# Altium project AMC_FMC_Carrier v4.PrjPcb (part 10 of 18)

## Sheet SUP_1.2_1.8.SchDoc: AMC FMC Carrier v4
size A4; CompanyName: WUT; Organization: WUT ISE; Address1: Warsaw Univeristy of Technology; Address2: Nowowiejska 15/19 00-665 Warsaw; Address3: t.przywozki@gmail.com; Revision: 1; SheetNumber: 11; SheetTotal: 29; Project: AMC FMC Carrier v4; ModifiedBy: -; CreateDate: XX/XX/XXXX; CheckedDate: -; Title2: Power P1V2 & P1V8; DivGrp: ISE; Designer: T. Przywozki; ModifiedDate: -; ProjectName: ADC/DAC MEZZANINE
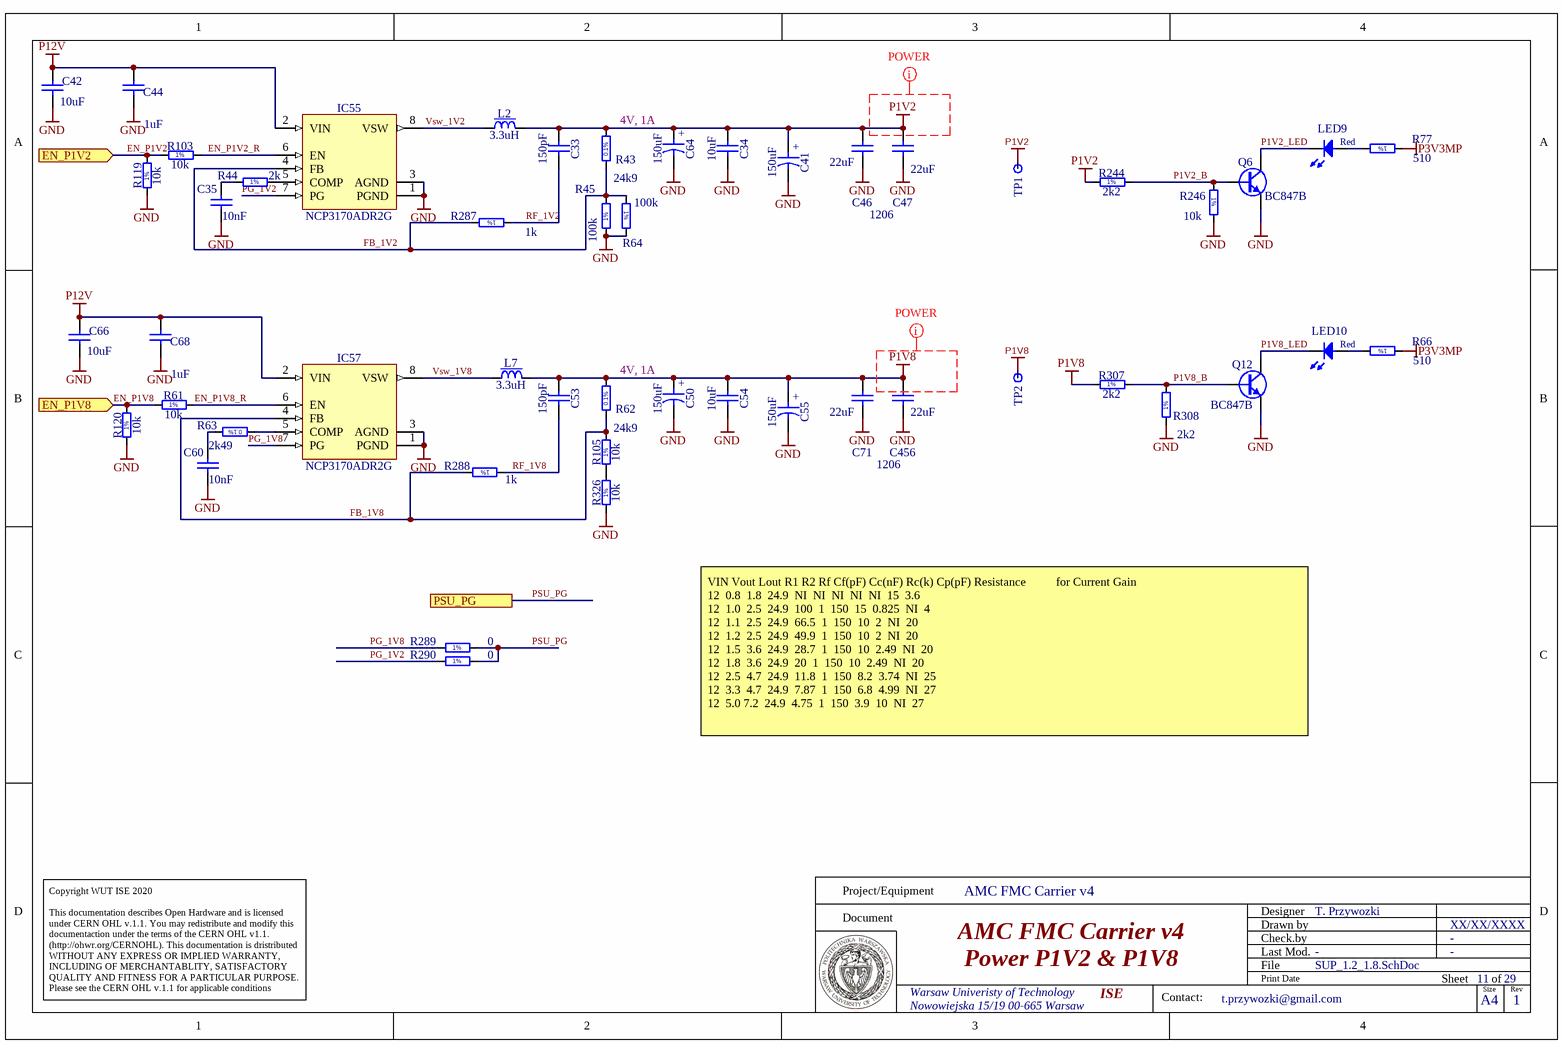
[diagram p17: SUP_1.2_1.8.SchDoc]

### Parts
C33  150pF  [CAPC1608X87N]
C34  10uF  [CAPC2012X135N]
C35  10nF  [CAPC1005X55N]
C41  150uF  [CAPMP7343X200N]
C42  10uF  [CAPC2012X135N]
C44  1uF  [CAPC1608X87N]
C46  22uF  [CAPC3216X180N]
C47  22uF  Case: 1206  [CAPC3216X180N]
C50  150uF  [CAPMP7343X200N]
C53  150pF  [CAPC1608X87N]
C54  10uF  [CAPC2012X135N]
C55  150uF  [CAPMP7343X200N]
C60  10nF  [CAPC1005X55N]
C64  150uF  [CAPMP7343X200N]
C66  10uF  [CAPC2012X135N]
C68  1uF  [CAPC1608X87N]
C71  22uF  [CAPC3216X180N]
C456  22uF  Case: 1206  [CAPC3216X180N]
IC55  NCP3170ADR2G  [SOIC127P600X175-8N]
IC57  NCP3170ADR2G  [SOIC127P600X175-8N]
L2  3.3uH  [IND_WURTH_WE-PD4_L]
L7  3.3uH  [IND_WURTH_WE-PD4_L]
LED9  Red  [LED_KINGBRIGHT_KPH-1608SURCK]
LED10  Red  [LED_KINGBRIGHT_KPH-1608SURCK]
Q6  BC847B  [SOT95P230X110-3N]
Q12  BC847B  [SOT95P230X110-3N]
R43  24k9  [RESC1608X55N]
R44  2k  [RESC1608X55N]
R45  100k  [RESC1005X40N]
R61  10k  [RESC1005X40N]
R62  24k9  [RESC1608X55N]
R63  2k49  [RESC1608X55N]
R64  100k  [RESC1005X40N]
R66  510  [RESC1005X40N]
R77  510  [RESC1005X40N]
R103  10k  [RESC1005X40N]
R105  10k  [RESC1005X40N]
R119  10k  [RESC1005X40N]
R120  10k  [RESC1005X40N]
R244  2k2  [RESC1005X40N]
R246  10k  [RESC1005X40N]
R287  1k  [RESC1005X40N]
R288  1k  [RESC1005X40N]
R289  0  [RESC1005X40N]
R290  0  [RESC1005X40N]
R307  2k2  [RESC1005X40N]
R308  2k2  [RESC1005X40N]
R326  10k  [RESC1005X40N]
TP1  Test Point  [TPS127]  (value not drawn)
TP2  Test Point  [TPS127]  (value not drawn)

### Ports
EN_P1V2 (in), EN_P1V8 (in), PSU_PG

### Nets
GND: C34.2 C35.2 C41.2 C42.1 C44.1 C46.2 C47.2 C50.2 C54.2 C55.2 C60.1 C64.2 C66.1 C68.1 C71.2 C456.2 IC55.1(PGND) IC55.3(AGND) IC57.1(PGND) IC57.3(AGND) Q6.2(E) Q12.2(E) R45.1 R64.2 R119.1 R120.1 R246.2 R308.1 R326.1
P1V2: C33.1 C34.1 C41.1 C46.1 C47.1 C64.1 L2.2 R43.2 R244.1 TP1.1
P1V8: C50.1 C53.1 C54.1 C55.1 C71.1 C456.1 L7.2 R62.2 R307.1 TP2.1
P3V3MP: R66.1 R77.1
P12V: C42.2 C44.2 C66.2 C68.2 IC55.2(VIN) IC57.2(VIN)
EN_P1V2: R103.1 R119.2 ; port EN_P1V2  [project net PM.EN_P1V2]
EN_P1V2_R: IC55.6(EN) R103.2
EN_P1V8: R61.1 R120.2 ; port EN_P1V8  [project net PM.EN_P1V8]
EN_P1V8_R: IC57.6(EN) R61.2
FB_1V2: IC55.4(FB) R43.1 R45.2 R64.1 R287.2
FB_1V8: IC57.4(FB) R62.1 R105.2 R288.2
P1V2_B: Q6.1(B) R244.2 R246.1
P1V2_LED: LED9.1(C) Q6.3(C)
P1V8_B: Q12.1(B) R307.2 R308.2
P1V8_LED: LED10.1(C) Q12.3(C)
PG_1V2: IC55.7(PG) R290.2
PG_1V8: IC57.7(PG) R289.2
PSU_PG: R289.1 R290.1 ; port PSU_PG  [project net PM.PGOOD_P1V0]
RF_1V2: C33.2 R287.1
RF_1V8: C53.2 R288.1
Vsw_1V2: IC55.8(VSW) L2.1
Vsw_1V8: IC57.8(VSW) L7.1
NetC35_1: C35.1 R44.2
NetC60_2: C60.2 R63.1
NetIC55_5: IC55.5(COMP) R44.1
NetIC57_5: IC57.5(COMP) R63.2
NetLED9_2: LED9.2(A) R77.2
NetLED10_2: LED10.2(A) R66.2
NetR105_1: R105.1 R326.2

### Layout directives
net class POWER: P1V2, P1V8

### Notes on the sheet
- 4V, 1A
- VIN	Vout	Lout	R1	R2	Rf	Cf(pF)	Cc(nF)	Rc(k)	Cp(pF) Resistance 									for Current Gain
  12 	0.8 	1.8 	24.9 	NI 	NI 	NI 	NI 	NI 	15 	3.6
  12 	1.0 	2.5 	24.9 	100 	1 	150 	15 	0.825 	NI 	4
  12 	1.1 	2.5 	24.9 	66.5 	1 	150 	10 	2 	NI 	20
  12 	1.2 	2.5 	24.9 	49.9 	1 	150 	10 	2 	NI 	20
  12 	1.5 	3.6 	24.9 	28.7 	1 	150 	10 	2.49 	NI 	20
  12 	1.8 	3.6 	24.9 	20 	1 	150 	10 	2.49 	NI 	20
  12 	2.5 	4.7 	24.9 	11.8 	1 	150 	8.2 	3.74 	NI 	25
  12 	3.3 	4.7 	24.9 	7.87 	1 	150 	6.8 	4.99 	NI 	27
  12 	5.0	7.2 	24.9 	4.75 	1 	150 	3.9 	10 	NI 	27
- Project/Equipment
- Document
- Designer
- Drawn by
- Check.by
- Copyright WUT ISE 2020
  This documentation describes Open Hardware and is licensed under CERN OHL v.1.1. You may redistribute and modify this documentaction under the terms of the CERN OHL v1.1.
  (http://ohwr.org/CERNOHL). This documentation is dristributed WITHOUT ANY EXPRESS OR IMPLIED WARRANTY, INCLUDING OF MERCHANTABLITY, SATISFACTORY QUALITY AND FITNESS FOR A PARTICULAR PURPOSE. Please see the CERN OHL v.1.1 for applicable conditions
- File
- Last Mod.
- Print Date
- Sheet
- Size
- A4
- of
- Rev
- Contact:
- (in symbol CAEM7343-20_150UF_2V_20%_LESR0009) +
- (in symbol R0402_0R_JUMPER) 1%
- (in symbol R0402_1K_1%_0.0625W_100PPM) 1%
- (in symbol R0402_2K2_1%_0.0625W_100PPM) 1%
- (in symbol R0402_10K_1%_0.0625W_100PPM) 1%
- (in symbol R0402_100K_1%_0.0625W_100PPM) 1%
- (in symbol R0402_510R_1%_0.0625W_100PPM) 1%
- (in symbol R0603_2K49_0.1%_0.063W_10PPM) 0.1%
- (in symbol R0603_2K_1%_0.1W_100PPM) 1%
- (in symbol R0603_24K9_0.1%_0.063W_10PPM) 0.1%

### Library data of the parts
C33 C53 = CC0603_150PF_50V_5%_NP0: Non-polarised capacitor; Part Description: SMD Multilayer Chip Ceramic Capacitor; Manufacturer: GENERIC; Manufacturer1 Part Number: 223886715151; Voltage: 50V; TC: NP0; Tolerance: ±5%; Table: Capacitors SMD; Part Number: CC0603_150PF_50V_5%_NP0; Component Kind: Standard; Component Type: Standard; Pin Count: 2; Value: 150pF; Status: Preferred; Manufacturer Part Number: CC0603_150PF_50V_5%_NP0; Case: 0603; Mounted: Yes; Socket: No; SMD: Yes; Manufacturer1 Example: PHYCOMP; Manufacturer1 ComponentHeight: 0.87mm; HelpURL: \\cern.ch\dfs\Applications\Altium\Datasheets\CC0603_NP0_PHYCOMP.pdf; Author: CERN DEM JLC; CreateDate: 2007-12-03; LatestRevisionDate: 2007-12-03
C34 C42 C54 C66 = CC0805_10UF_16V_10%_X5R: as C40 on sheet SUP_2.5_FMC; Part Number: CC0805_10UF_16V_10%_X5R; Component Kind: Standard; Component Type: Standard; Pin Count: 2; Value: 10uF; Status: Preferred; Manufacturer Part Number: CC0805_10UF_16V_10%_X5R; Case: 0805; Mounted: Yes; Socket: No; SMD: Yes; Manufacturer1 Example: KEMET; Manufacturer1 ComponentHeight: 1.4mm; HelpURL: \\cern.ch\dfs\Applications\Altium\Datasheets\CC1206_X5R_KEMET.pdf; Author: CERN DEM JLC; CreateDate: 2007-12-03; LatestRevisionDate: 2007-12-03
C35 C60 = CC0402_10NF_16V_10%_X7R: as C547 on sheet SUP_1.5_3.3; Part Number: CC0402_10NF_16V_10%_X7R; Component Kind: Standard; Component Type: Standard; Pin Count: 2; Value: 10nF; Status: Not Recommended; Manufacturer Part Number: CC0402_10NF_16V_10%_X7R; Case: 0402; Mounted: Yes; Socket: No; SMD: Yes; Manufacturer1 Example: PHYCOMP; Manufacturer1 ComponentHeight: 0.55mm; HelpURL: \\cern.ch\dfs\Applications\Altium\Datasheets\CC0402_X7R_PHYCOMP.pdf; Author: CERN DEM JLC; CreateDate: 2007-12-03; LatestRevisionDate: 2007-12-03
C41 C50 C55 C64 = CAEM7343-20_150UF_2V_20%_LESR0009: as C528 on sheet SUP_1.5_3.3; Part Number: CAEM7343-20_150UF_2V_20%_LESR0009; Component Kind: Standard; Component Type: Standard; Pin Count: 2; Value: 150uF; Status: None; Mounted: Yes; Socket: No; SMD: Yes; Sense: No; ComponentHeight: 2mm; HelpURL: \\cern.ch\dfs\Applications\Altium\Datasheets\CAEM_MURATA_ECAS.pdf; Author: CERN DEM JLC; CreateDate: 11.01.2012; LatestRevisionDate: 11.01.2012
C44 C68 = CC0603_1UF_16V_10%_X7R: as C816 on sheet POWER_Management; Part Number: CC0603_1UF_16V_10%_X7R; Component Kind: Standard; Component Type: Standard; Pin Count: 2; Value: 1uF; Status: Preferred; Manufacturer Part Number: CC0603_1uF_16V_10%_X7R; Case: 0603; Mounted: Yes; Socket: No; SMD: Yes; Manufacturer1 Example: PHYCOMP; Manufacturer1 ComponentHeight: 0.87mm; HelpURL: \\cern.ch\dfs\Applications\Altium\Datasheets\CC0805_X5R_PHYCOMP_HC.pdf; Author: CERN DEM JLC; CreateDate: 2007-12-03; LatestRevisionDate: 2007-12-03
C46 C47 C71 C456 = CC1206_22UF_10V_10%_X7R: as C79 on sheet SUP_2.5_FMC; Part Number: CC1206_22UF_10V_10%_X7R; Component Kind: Standard; Component Type: Standard; Pin Count: 2; Value: 22uF; Status: Preferred; Manufacturer Part Number: CC1206_22UF_10V_10%_X7R; Mounted: Yes; Socket: No; SMD: Yes; Manufacturer1 Example: MURATA; Manufacturer1 ComponentHeight: 1.8mm; HelpURL: \\cern.ch\dfs\Applications\Altium\Datasheets\CC1206_X7R_MURATA_GRM-HI-CAP.pdf; Author: CERN DEM JLC; CreateDate: 08/06/2010; LatestRevisionDate: 08/06/2010
IC55 IC57 = NCP3170ADR2G: Synchronous PWM Switching Converter; Manufacturer: ON SEMICONDUCTOR; PressFit: No; Bonding: No; Part Number: NCP3170ADR2G; Component Kind: Standard; Component Type: Standard; Device: NCP3170ADR2G; PackageDescription: SOIC 8, Pitch 1.27mm, Body 4x5mm, IPC Medium Density; Part Description: Synchronous PWM Switching Converter; Manufacturer Part Number: NCP3170ADR2G; Pin Count: 8; Case: SOIC8; Mounted: Yes; Socket: No; SMD: Yes; Sense: No; ComponentHeight: 1.75mm; Author: CERN DEM MR; HelpURL: \\cern.ch\dfs\Applications\Altium\Datasheets\NCP3170ADR2G.pdf; CreateDate: 30.05.2016; LatestRevisionDate: 30.05.2016
L2 L7 = IND_3.3UH_20%_WURTH_WE-PD4_74456033: Inductor With Core; Part Description: Power Inductor (WE-PD 4 Series); Manufacturer: WURTH ELEKTRONIK; Power: 5.3A; Resistance: 0.015R; Tolerance: ±20%; Part Number: IND_3.3UH_20%_WURTH_WE-PD4_74456033; Component Kind: Standard; Component Type: Standard; Pin Count: 2; Value: 3.3uH; Status: None; Manufacturer Part Number: 74456033; Mounted: Yes; Socket: No; SMD: Yes; Sense: No; ComponentHeight: 5.3mm; HelpURL: \\cern.ch\dfs\Applications\Altium\Datasheets\IND_WURTH_WE-PD4_74456033.pdf; Author: CERN DEM JLC; CreateDate: 07.06.2011; LatestRevisionDate: 24.01.2012
LED9 LED10 = LED_KINGBRIGHT_KPH-1608SURCK: as LED6 on sheet POWER_Management; Part Number: LED_KINGBRIGHT_KPH-1608SURCK; Component Kind: Standard; Component Type: Standard; Color: Red; PackageDescription: SMT Hyper Red LED, Case 0603, Body L 1.6 x W 0.8mm H 0.65mm; Manufacturer: KINGBRIGHT; Manufacturer Part Number: KPH-1608SURCK; Pin Count: 2; Mounted: Yes; Socket: No; SMD: Yes; Sense: No; ComponentHeight: 0.65mm; HelpURL: \\cern.ch\dfs\Applications\Altium\Datasheets\LED_KINGBRIGHT_KPH-1608SURCK.pdf; Author: CERN DEM JLC; CreateDate: 03.07.2017; LatestRevisionDate: 03.07.2017
Q6 Q12 = BC847B: NPN Transistor; Part Description: 45V 100mA NPN general-purpose transistors; Manufacturer: NXP SEMICONDUCTORS; PressFit: No; Bonding: No; Part Number: BC847B; Component Kind: Standard; Component Type: Standard; Device: BC847B; PackageDescription: SOT23, 3 pin, Pitch 0.95mm - 1.3mm W X 2.9mm L X 1.1mm H, IPC Medium Density; Manufacturer Part Number: BC847B; Pin Count: 3; Case: SOT23-3; Mounted: Yes; Socket: No; SMD: Yes; Sense: No; ComponentHeight: 1.1mm; HelpURL: \\cern.ch\dfs\Applications\Altium\Datasheets\BC847B.pdf; Author: CERN DEM JLC; CreateDate: 14.06.2011; LatestRevisionDate: 14.06.2011
R43 R62 = R0603_24K9_0.1%_0.063W_10PPM: Resistor - 0.1%; Part Description: Thin Film Chip Resistor; Manufacturer: GENERIC; Manufacturer1 Part Number: RN73C1J24K9BTDF; Power: 0.063W; TC: ±10ppm; Table: Resistors SMD; Part Number: R0603_24K9_0.1%_0.063W_10PPM; Component Kind: Standard; Component Type: Standard; Pin Count: 2; Value: 24k9; Status: Not recommended; Tolerance: ±0.1%; Manufacturer Part Number: R0603_24K9_0.1%_0.063W_10PPM; Case: 0603; Mounted: Yes; Socket: No; SMD: Yes; Manufacturer1 Example: TYCO HOLSWORTHY; Manufacturer1 ComponentHeight: 0.5mm; HelpURL: \\cern.ch\dfs\Applications\Altium\Datasheets\R0603_Tyco_RN73.pdf; Author: CERN DEM JLC; CreateDate: 2007-12-03; LatestRevisionDate: 2008-03-13
R44 = R0603_2K_1%_0.1W_100PPM: Resistor - 1%; Part Description: General Purpose Thick Film Chip Resistor; Manufacturer: GENERIC; Manufacturer1 Part Number: NRC06F2001TRF; Power: 0.1W; TC: ±100ppm/°C; PressFit: No; Part Number: R0603_2K_1%_0.1W_100PPM; Component Kind: Standard; Component Type: Standard; Pin Count: 2; Value: 2k; Status: Preferred; Tolerance: ±1%; Manufacturer Part Number: R0603_2K_1%_0.1W_100PPM; Case: 0603; Mounted: Yes; Sense: No; Socket: No; SMD: Yes; Manufacturer1 Example: NIC COMPONENT; Manufacturer1 ComponentHeight: 0.55mm; HelpURL: \\cern.ch\dfs\Applications\Altium\Datasheets\R0603_NIC_NRC.pdf; Author: CERN DEM JLC; CreateDate: 03.12.2007; LatestRevisionDate: 13.03.2008
R45 R64 = R0402_100K_1%_0.0625W_100PPM: as R269 on sheet POWER_Management; Part Number: R0402_100K_1%_0.0625W_100PPM; Component Kind: Standard; Component Type: Standard; Pin Count: 2; Value: 100k; Status: Not recommended; Power: 0.0625W; Tolerance: ±1%; Manufacturer Part Number: R0402_100K_1%_0.0625W_100PPM; Case: 0402; Mounted: Yes; Socket: No; SMD: Yes; Manufacturer1 Example: YAGEO PHYCOMP; Manufacturer1 ComponentHeight: 0.4mm; HelpURL: \\cern.ch\dfs\Applications\Altium\Datasheets\R0402_Phycomp_RC0402.pdf; Author: CERN DEM JLC; CreateDate: 2007-12-03; LatestRevisionDate: 2012-10-17
R61 R103 R105 R119 R120 R246 R326 = R0402_10K_1%_0.0625W_100PPM: as R37-R40 on sheet POWER_Management; Part Number: R0402_10K_1%_0.0625W_100PPM; Component Kind: Standard; Component Type: Standard; Pin Count: 2; Value: 10k; Status: Not recommended; Power: 0.0625W; Tolerance: ±1%; Manufacturer Part Number: R0402_10K_1%_0.0625W_100PPM; Case: 0402; Mounted: Yes; Socket: No; SMD: Yes; Manufacturer1 Example: YAGEO PHYCOMP; Manufacturer1 ComponentHeight: 0.4mm; HelpURL: \\cern.ch\dfs\Applications\Altium\Datasheets\R0402_Phycomp_RC0402.pdf; Author: CERN DEM JLC; CreateDate: 2007-12-03; LatestRevisionDate: 2012-10-17
R63 = R0603_2K49_0.1%_0.063W_10PPM: Resistor - 0.1%; Part Description: Thin Film Chip Resistor; Manufacturer: GENERIC; Manufacturer1 Part Number: RN73C1J2K49BTDF; Power: 0.063W; TC: ±10ppm; Table: Resistors SMD; Part Number: R0603_2K49_0.1%_0.063W_10PPM; Component Kind: Standard; Component Type: Standard; Pin Count: 2; Value: 2k49; Status: Not recommended; Tolerance: ±0.1%; Manufacturer Part Number: R0603_2K49_0.1%_0.063W_10PPM; Case: 0603; Mounted: Yes; Socket: No; SMD: Yes; Manufacturer1 Example: TYCO HOLSWORTHY; Manufacturer1 ComponentHeight: 0.5mm; HelpURL: \\cern.ch\dfs\Applications\Altium\Datasheets\R0603_Tyco_RN73.pdf; Author: CERN DEM JLC; CreateDate: 2007-12-03; LatestRevisionDate: 2008-03-13
R66 R77 = R0402_510R_1%_0.0625W_100PPM: as R74 on sheet SUP_2.5_FMC; Part Number: R0402_510R_1%_0.0625W_100PPM; Component Kind: Standard; Component Type: Standard; Pin Count: 2; Value: 510; Status: Not recommended; Power: 0.0625W; Tolerance: ±1%; Manufacturer Part Number: R0402_510R_1%_0.0625W_100PPM; Case: 0402; Mounted: Yes; Socket: No; SMD: Yes; Manufacturer1 Example: YAGEO PHYCOMP; Manufacturer1 ComponentHeight: 0.4mm; HelpURL: \\cern.ch\dfs\Applications\Altium\Datasheets\R0402_Phycomp_RC0402.pdf; Author: CERN DEM JLC; CreateDate: 2007-12-03; LatestRevisionDate: 2012-10-17
R244 R307 R308 = R0402_2K2_1%_0.0625W_100PPM: as R81 on sheet SUP_1.5_3.3; Part Number: R0402_2K2_1%_0.0625W_100PPM; Component Kind: Standard; Component Type: Standard; Pin Count: 2; Value: 2k2; Status: Not recommended; Power: 0.0625W; Tolerance: ±1%; Manufacturer Part Number: R0402_2K2_1%_0.0625W_100PPM; Case: 0402; Mounted: Yes; Socket: No; SMD: Yes; Manufacturer1 Example: YAGEO PHYCOMP; Manufacturer1 ComponentHeight: 0.4mm; HelpURL: \\cern.ch\dfs\Applications\Altium\Datasheets\R0402_Phycomp_RC0402.pdf; Author: CERN DEM JLC; CreateDate: 2007-12-03; LatestRevisionDate: 2012-10-17
R287 R288 = R0402_1K_1%_0.0625W_100PPM: Resistor - 1%; Part Description: General Purpose Thick Film Chip Resistor; Manufacturer: GENERIC; Manufacturer1 Part Number: 232270671002L; TC: ±100ppm/°C; Table: Resistors SMD; Part Number: R0402_1K_1%_0.0625W_100PPM; Component Kind: Standard; Component Type: Standard; Pin Count: 2; Value: 1k; Status: Not recommended; Power: 0.0625W; Tolerance: ±1%; Manufacturer Part Number: R0402_1K_1%_0.0625W_100PPM; Case: 0402; Mounted: Yes; Socket: No; SMD: Yes; Manufacturer1 Example: YAGEO PHYCOMP; Manufacturer1 ComponentHeight: 0.4mm; HelpURL: \\cern.ch\dfs\Applications\Altium\Datasheets\R0402_Phycomp_RC0402.pdf; Author: CERN DEM JLC; CreateDate: 2007-12-03; LatestRevisionDate: 2012-10-17
R289 R290 = R0402_0R_JUMPER: as R258 on sheet SUP_2.5_FMC; Part Number: R0402_0R_JUMPER; Component Kind: Standard; Component Type: Standard; Pin Count: 2; Value: 0; Status: Not recommended; Manufacturer Part Number: R0402_0R_JUMPER; Case: 0402; Mounted: Yes; Socket: No; SMD: Yes; Manufacturer1 Example: YAGEO PHYCOMP; Manufacturer1 ComponentHeight: 0.4mm; HelpURL: \\cern.ch\dfs\Applications\Altium\Datasheets\R0402_Phycomp_RC0402.pdf; Author: CERN DEM JLC; CreateDate: 2007-12-03; LatestRevisionDate: 2012-10-17
TP1 TP2 = SMD_PAD_1.27X1.27MM: as TP8 on sheet SUP_2.5_FMC; Part Number: SMD_PAD_1.27X1.27MM; Component Kind: Standard (No BOM); Component Type: Standard (No BOM); Pin Count: 1; Family: Test Point; Socket: No; SMD: Yes; Sense: No; Status: None; ComponentHeight: 0mm; HelpURL: Undefined; Author: CERN DEM JLC; CreateDate: 12.01.2008; LatestRevisionDate: 12.01.2008; PackageDescription: 1.27mm x 1.27mm PCB Copper Area (SMD Test Point)

## Sheet SUP_1V.SchDoc: AMC FMC Carrier v4
size A4; CompanyName: WUT; Organization: WUT ISE; Address1: Warsaw Univeristy of Technology; Address2: Nowowiejska 15/19 00-665 Warsaw; Address3: t.przywozki@gmail.com; Revision: 1; SheetNumber: 14; SheetTotal: 29; Project: AMC FMC Carrier v4; ModifiedBy: -; CreateDate: XX/XX/XXXX; CheckedDate: -; Title2: Power P1V0; DivGrp: ISE; Designer: T. Przywozki; ModifiedDate: -; ProjectName: ADC/DAC MEZZANINE
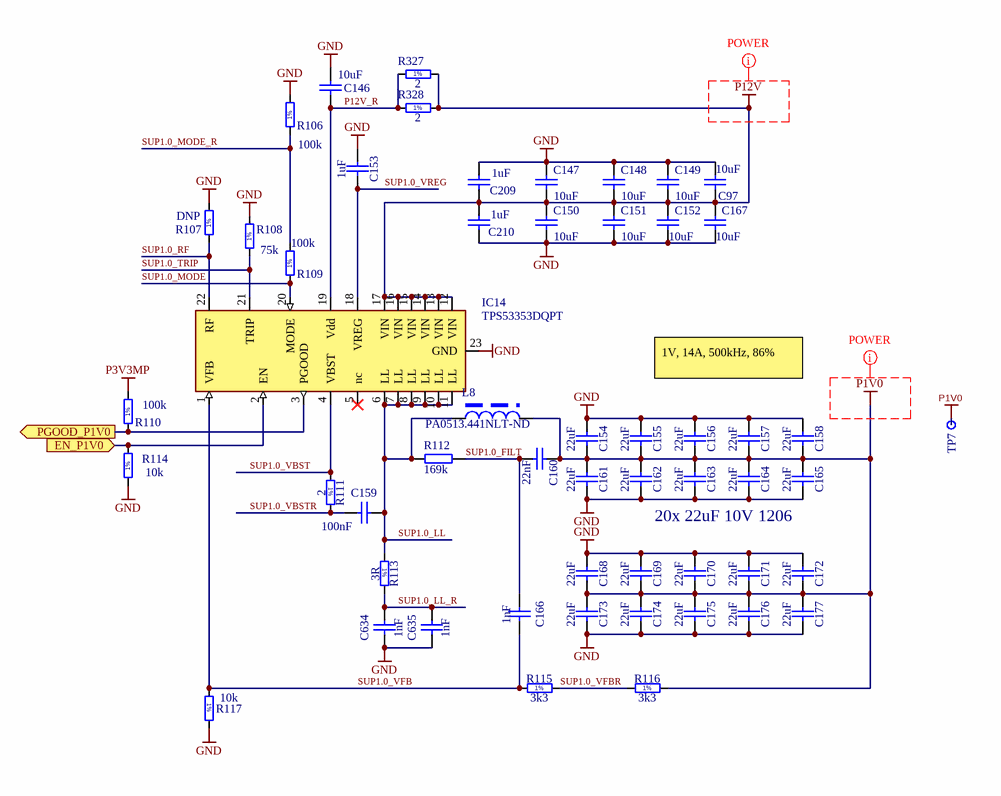
[diagram p18: SUP_1V.SchDoc]

### Parts
C97  10uF  [CAPC2012X135N]
C146  10uF  [CAPC2012X135N]
C147  10uF  [CAPC2012X135N]
C148  10uF  [CAPC2012X135N]
C149  10uF  [CAPC2012X135N]
C150  10uF  [CAPC2012X135N]
C151  10uF  [CAPC2012X135N]
C152  10uF  [CAPC2012X135N]
C153  1uF  [CAPC1608X87N]
C154  22uF  [CAPC3216X180N]
C155  22uF  [CAPC3216X180N]
C156  22uF  [CAPC3216X180N]
C157  22uF  [CAPC3216X180N]
C158  22uF  [CAPC3216X180N]
C159  100nF  [CAPC1005X55N]
C160  22nF  [CAPC1608X87N]
C161  22uF  [CAPC3216X180N]
C162  22uF  [CAPC3216X180N]
C163  22uF  [CAPC3216X180N]
C164  22uF  [CAPC3216X180N]
C165  22uF  [CAPC3216X180N]
C166  1nF  [CAPC1005X55N]
C167  10uF  [CAPC2012X135N]
C168  22uF  [CAPC3216X180N]
C169  22uF  [CAPC3216X180N]
C170  22uF  [CAPC3216X180N]
C171  22uF  [CAPC3216X180N]
C172  22uF  [CAPC3216X180N]
C173  22uF  [CAPC3216X180N]
C174  22uF  [CAPC3216X180N]
C175  22uF  [CAPC3216X180N]
C176  22uF  [CAPC3216X180N]
C177  22uF  [CAPC3216X180N]
C209  1uF  [CAPC1608X87N]
C210  1uF  [CAPC1608X87N]
C634  1nF  [CAPC1005X55N]
C635  1nF  [CAPC1005X55N]
IC14  TPS53353DQPT  [LCCS50P600X500X150-22N]
L8  PA0513.441NLT-ND  [IND_PA0513]
R106  100k  [RESC1005X40N]
R107  DNP  [RESC1608X55N]
R108  75k  [RESC1608X55N]
R109  100k  [RESC1005X40N]
R110  100k  [RESC1005X40N]
R111  2  [RESC1608X55N]
R112  169k  [0603R]
R113  3R  [RESC3216X65N]
R114  10k  [RESC1005X40N]
R115  3k3  [RESC1608X55N]
R116  3k3  [RESC1608X55N]
R117  10k  [RESC1005X40N]
R327  2  [RESC1608X55N]
R328  2  [RESC1608X55N]
TP7  Test Point  [TPS127]  (value not drawn)

### Ports
EN_P1V0 (in), PGOOD_P1V0 (out)

### Nets
GND: C97.1 C146.2 C147.2 C148.2 C149.2 C150.1 C151.1 C152.1 C153.1 C154.1 C155.1 C156.1 C157.1 C158.1 C161.2 C162.2 C163.2 C164.2 C165.2 C167.1 C168.1 C169.1 C170.1 C171.1 C172.1 C173.2 C174.2 C175.2 C176.2 C177.2 C209.2 C210.1 C634.2 C635.2 IC14.23(GND) R106.2 R107.2 R108.2 R114.1 R117.2
P1V0: C154.2 C155.2 C156.2 C157.2 C158.2 C160.2 C161.1 C162.1 C163.1 C164.1 C165.1 C168.2 C169.2 C170.2 C171.2 C172.2 C173.1 C174.1 C175.1 C176.1 C177.1 L8.2 R116.2 TP7.1
P3V3MP: R110.2
P12V: C97.2 C147.1 C148.1 C149.1 C150.2 C151.2 C152.2 C167.2 C209.1 C210.2 IC14.12(VIN) IC14.13(VIN) IC14.14(VIN) IC14.15(VIN) IC14.16(VIN) IC14.17(VIN) R327.2 R328.2
P12V_R: C146.1 IC14.19(Vdd) R327.1 R328.1
PM.EN_P1V0: IC14.2(EN) R114.2 ; port EN_P1V0
PM.PGOOD_P1V0: IC14.3(PGOOD) R110.1 ; port PGOOD_P1V0
SUP1.0_FILT: C160.1 C166.2 R112.1
SUP1.0_LL: C159.1 IC14.6(LL) IC14.7(LL) IC14.8(LL) IC14.9(LL) IC14.10(LL) IC14.11(LL) L8.1 R112.2 R113.1
SUP1.0_LL_R: C634.1 C635.1 R113.2
SUP1.0_MODE: IC14.20(MODE) R109.1
SUP1.0_MODE_R: R106.1 R109.2
SUP1.0_RF: IC14.22(RF) R107.1
SUP1.0_TRIP: IC14.21(TRIP) R108.1
SUP1.0_VBST: IC14.4(VBST) R111.1
SUP1.0_VBSTR: C159.2 R111.2
SUP1.0_VFB: C166.1 IC14.1(VFB) R115.1 R117.1
SUP1.0_VFBR: R115.2 R116.1
SUP1.0_VREG: C153.2 IC14.18(VREG)

Not connected (* = marked no-connect by the designer): IC14 5(nc)*

### Layout directives
net class POWER: P1V0, P12V

### Notes on the sheet
- 1V, 14A, 500kHz, 86%
- 20x 22uF 10V 1206
- Project/Equipment
- Document
- Designer
- Drawn by
- Check.by
- Copyright WUT ISE 2020
  This documentation describes Open Hardware and is licensed under CERN OHL v.1.1. You may redistribute and modify this documentaction under the terms of the CERN OHL v1.1.
  (http://ohwr.org/CERNOHL). This documentation is dristributed WITHOUT ANY EXPRESS OR IMPLIED WARRANTY, INCLUDING OF MERCHANTABLITY, SATISFACTORY QUALITY AND FITNESS FOR A PARTICULAR PURPOSE. Please see the CERN OHL v.1.1 for applicable conditions
- File
- Last Mod.
- Print Date
- Sheet
- Size
- A4
- of
- Rev
- Contact:
- (in symbol R0402_10K_1%_0.0625W_100PPM) 1%
- (in symbol R0402_100K_1%_0.0625W_100PPM) 1%
- (in symbol R0603_2R_1%_0.1W_200PPM) 1%
- (in symbol R0603_3K3_1%_0.1W_100PPM) 1%
- (in symbol R0603_75K_1%_0.1W_100PPM) 1%
- (in symbol R1206_3R_1%_0.25W_200PPM) 1%

### Library data of the parts
C97 C146-C152 C167 = CC0805_10UF_16V_10%_X5R: as C40 on sheet SUP_2.5_FMC; Part Number: CC0805_10UF_16V_10%_X5R; Component Kind: Standard; Component Type: Standard; Pin Count: 2; Value: 10uF; Status: Preferred; Manufacturer Part Number: CC0805_10UF_16V_10%_X5R; Case: 0805; Mounted: Yes; Socket: No; SMD: Yes; Manufacturer1 Example: KEMET; Manufacturer1 ComponentHeight: 1.4mm; HelpURL: \\cern.ch\dfs\Applications\Altium\Datasheets\CC1206_X5R_KEMET.pdf; Author: CERN DEM JLC; CreateDate: 2007-12-03; LatestRevisionDate: 2007-12-03
C153 C209 C210 = CC0603_1UF_16V_10%_X7R: as C816 on sheet POWER_Management; Part Number: CC0603_1UF_16V_10%_X7R; Component Kind: Standard; Component Type: Standard; Pin Count: 2; Value: 1uF; Status: Preferred; Manufacturer Part Number: CC0603_1uF_16V_10%_X7R; Case: 0603; Mounted: Yes; Socket: No; SMD: Yes; Manufacturer1 Example: PHYCOMP; Manufacturer1 ComponentHeight: 0.87mm; HelpURL: \\cern.ch\dfs\Applications\Altium\Datasheets\CC0805_X5R_PHYCOMP_HC.pdf; Author: CERN DEM JLC; CreateDate: 2007-12-03; LatestRevisionDate: 2007-12-03
C154-C158 C161-C165 C168-C177 = CC1206_22UF_10V_10%_X7R: as C79 on sheet SUP_2.5_FMC; Part Number: CC1206_22UF_10V_10%_X7R; Component Kind: Standard; Component Type: Standard; Pin Count: 2; Value: 22uF; Status: Preferred; Manufacturer Part Number: CC1206_22UF_10V_10%_X7R; Case: 1206; Mounted: Yes; Socket: No; SMD: Yes; Manufacturer1 Example: MURATA; Manufacturer1 ComponentHeight: 1.8mm; HelpURL: \\cern.ch\dfs\Applications\Altium\Datasheets\CC1206_X7R_MURATA_GRM-HI-CAP.pdf; Author: CERN DEM JLC; CreateDate: 2010-06-08; LatestRevisionDate: 2010-06-08
C159 = CC0402_100NF_16V_10%_X7R: as C77 on sheet SUP_2.5_FMC; Part Number: CC0402_100NF_16V_10%_X7R; Component Kind: Standard; Component Type: Standard; Pin Count: 2; Value: 100nF; Status: Not Recommended; Manufacturer Part Number: CC0402_100NF_16V_10%_X7R; Case: 0402; Mounted: Yes; Socket: No; SMD: Yes; Manufacturer1 Example: PHYCOMP; Manufacturer1 ComponentHeight: 0.55mm; HelpURL: \\cern.ch\dfs\Applications\Altium\Datasheets\CC0402_X7R_PHYCOMP.pdf; Author: CERN DEM JLC; CreateDate: 2007-12-03; LatestRevisionDate: 2007-12-03
C160 = CC0603_22NF_50V_10%_X7R: Non-polarised capacitor; Part Description: SMD Multilayer Chip Ceramic Capacitor; Manufacturer: GENERIC; Manufacturer1 Part Number: 223858615641; Voltage: 50V; TC: X7R; Tolerance: ±10%; Table: Capacitors SMD; Part Number: CC0603_22NF_50V_10%_X7R; Component Kind: Standard; Component Type: Standard; Pin Count: 2; Value: 22nF; Status: Preferred; Manufacturer Part Number: CC0603_22NF_50V_10%_X7R; Case: 0603; Mounted: Yes; Socket: No; SMD: Yes; Manufacturer1 Example: PHYCOMP; Manufacturer1 ComponentHeight: 0.87mm; HelpURL: \\cern.ch\dfs\Applications\Altium\Datasheets\CC0603_X7R_PHYCOMP.pdf; Author: CERN DEM JLC; CreateDate: 2007-12-03; LatestRevisionDate: 2007-12-03
C166 C634 C635 = CC0402_1NF_50V_10%_X7R: Non-polarised capacitor; Part Description: SMD Multilayer Chip Ceramic Capacitor; Manufacturer: GENERIC; Manufacturer1 Part Number: 223858715623; Voltage: 50V; TC: X7R; Tolerance: ±10%; Table: Capacitors SMD; Part Number: CC0402_1NF_50V_10%_X7R; Component Kind: Standard; Component Type: Standard; Pin Count: 2; Value: 1nF; Status: Not Recommended; Manufacturer Part Number: CC0402_1NF_50V_10%_X7R; Case: 0402; Mounted: Yes; Socket: No; SMD: Yes; Manufacturer1 Example: PHYCOMP; Manufacturer1 ComponentHeight: 0.55mm; HelpURL: \\cern.ch\dfs\Applications\Altium\Datasheets\CC0402_X7R_PHYCOMP.pdf; Author: CERN DEM JLC; CreateDate: 2007-12-03; LatestRevisionDate: 2007-12-03
IC14 = PM_TPS53353: High-Efficiency 20-A Synchronous Buck Converter with Eco-mode™; Supplier 1: Digi-Key; Supplier Part Number 1: 296-29490-1-ND
L8 = L_POWER_PA1513_440nH: 440nH, 30A, 0.32mOhm; Supplier 1: Mouser; Supplier Part Number 1: 673-PA0513.441NLT
R106 R109 R110 = R0402_100K_1%_0.0625W_100PPM: as R269 on sheet POWER_Management; Part Number: R0402_100K_1%_0.0625W_100PPM; Component Kind: Standard; Component Type: Standard; Pin Count: 2; Value: 100k; Status: Not recommended; Power: 0.0625W; Tolerance: ±1%; Manufacturer Part Number: R0402_100K_1%_0.0625W_100PPM; Case: 0402; Mounted: Yes; Socket: No; SMD: Yes; Manufacturer1 Example: YAGEO PHYCOMP; Manufacturer1 ComponentHeight: 0.4mm; HelpURL: \\cern.ch\dfs\Applications\Altium\Datasheets\R0402_Phycomp_RC0402.pdf; Author: CERN DEM JLC; CreateDate: 2007-12-03; LatestRevisionDate: 2012-10-17
R107 = R0603_75K_1%_0.1W_100PPM: Resistor - 1%; Part Description: General Purpose Thick Film Chip Resistor; Manufacturer: GENERIC; Manufacturer1 Part Number: NRC06F7502TRF; Value: 75k; Power: 0.1W; TC: ±100ppm/°C; Table: Resistors SMD; Part Number: R0603_75K_1%_0.1W_100PPM; Component Kind: Standard; Component Type: Standard; Pin Count: 2; Status: Preferred; Tolerance: ±1%; Manufacturer Part Number: R0603_75K_1%_0.1W_100PPM; Case: 0603; Mounted: Yes; Socket: No; SMD: Yes; Manufacturer1 Example: NIC COMPONENT; Manufacturer1 ComponentHeight: 0.55mm; HelpURL: \\cern.ch\dfs\Applications\Altium\Datasheets\R0603_NIC_NRC.pdf; Author: CERN DEM JLC; CreateDate: 2007-12-03; LatestRevisionDate: 2008-03-13
R108 = R0603_75K_1%_0.1W_100PPM: Resistor - 1%; Part Description: General Purpose Thick Film Chip Resistor; Manufacturer: GENERIC; Manufacturer1 Part Number: NRC06F7502TRF; Power: 0.1W; TC: ±100ppm/°C; Table: Resistors SMD; Part Number: R0603_75K_1%_0.1W_100PPM; Component Kind: Standard; Component Type: Standard; Pin Count: 2; Value: 75k; Status: Preferred; Tolerance: ±1%; Manufacturer Part Number: R0603_75K_1%_0.1W_100PPM; Case: 0603; Mounted: Yes; Socket: No; SMD: Yes; Manufacturer1 Example: NIC COMPONENT; Manufacturer1 ComponentHeight: 0.55mm; HelpURL: \\cern.ch\dfs\Applications\Altium\Datasheets\R0603_NIC_NRC.pdf; Author: CERN DEM JLC; CreateDate: 2007-12-03; LatestRevisionDate: 2008-03-13
R111 R327 R328 = R0603_2R_1%_0.1W_200PPM: Resistor - 1%; Part Description: General Purpose Thick Film Chip Resistor; Manufacturer: GENERIC; Manufacturer1 Part Number: 232270462008L or RC0603FR-072RL; Power: 0.1W; TC: ±200ppm/°C; Table: Resistors SMD; Part Number: R0603_2R_1%_0.1W_200PPM; Component Kind: Standard; Component Type: Standard; Pin Count: 2; Value: 2; Status: Preferred; Tolerance: ±1%; Manufacturer Part Number: R0603_2R_1%_0.1W_200PPM; Case: 0603; Mounted: Yes; Socket: No; SMD: Yes; Manufacturer1 Example: YAGEO PHYCOMP; Manufacturer1 ComponentHeight: 0.65mm; HelpURL: \\cern.ch\dfs\Applications\Altium\Datasheets\R0603_Tyco_RN73.pdf; Author: CERN DEM JLC; CreateDate: 2007-12-03; LatestRevisionDate: 2012-10-17
R112 = RES_0603: SMD Resistor; Supplier 1: Newark; Supplier Part Number 1: 39K0073
R113 = R1206_3R_1%_0.25W_200PPM: Resistor - 1%; Part Description: General Purpose Thick Film Chip Resistor; Manufacturer: GENERIC; Manufacturer1 Part Number: 232272463008; Power: 0.25W; TC: ±200ppm/°C; Table: Resistors SMD; Part Number: R1206_3R_1%_0.25W_200PPM; Component Kind: Standard; Component Type: Standard; Pin Count: 2; Value: 3R; Status: Preferred; Tolerance: ±1%; Manufacturer Part Number: R1206_3R_1%_0.25W_200PPM; Case: 1206; Mounted: Yes; Socket: No; SMD: Yes; Manufacturer1 Example: PHYCOMP; Manufacturer1 ComponentHeight: 0.65mm; HelpURL: \\cern.ch\dfs\Applications\Altium\Datasheets\R1206_Phycomp_RC1206.pdf; Author: CERN DEM JLC; CreateDate: 2007-12-03; LatestRevisionDate: 2009-06-24
R114 R117 = R0402_10K_1%_0.0625W_100PPM: as R37-R40 on sheet POWER_Management; Part Number: R0402_10K_1%_0.0625W_100PPM; Component Kind: Standard; Component Type: Standard; Pin Count: 2; Value: 10k; Status: Not recommended; Power: 0.0625W; Tolerance: ±1%; Manufacturer Part Number: R0402_10K_1%_0.0625W_100PPM; Case: 0402; Mounted: Yes; Socket: No; SMD: Yes; Manufacturer1 Example: YAGEO PHYCOMP; Manufacturer1 ComponentHeight: 0.4mm; HelpURL: \\cern.ch\dfs\Applications\Altium\Datasheets\R0402_Phycomp_RC0402.pdf; Author: CERN DEM JLC; CreateDate: 2007-12-03; LatestRevisionDate: 2012-10-17
R115 R116 = R0603_3K3_1%_0.1W_100PPM: as R72 on sheet SUP_1.5_3.3; Part Number: R0603_3K3_1%_0.1W_100PPM; Component Kind: Standard; Component Type: Standard; Pin Count: 2; Value: 3k3; Status: Preferred; Tolerance: ±1%; Manufacturer Part Number: R0603_3K3_1%_0.1W_100PPM; Case: 0603; Mounted: Yes; Socket: No; SMD: Yes; Manufacturer1 Example: NIC COMPONENT; Manufacturer1 ComponentHeight: 0.55mm; HelpURL: \\cern.ch\dfs\Applications\Altium\Datasheets\R0603_NIC_NRC.pdf; Author: CERN DEM JLC; CreateDate: 2007-12-03; LatestRevisionDate: 2008-03-13
TP7 = SMD_PAD_1.27X1.27MM: as TP8 on sheet SUP_2.5_FMC; Part Number: SMD_PAD_1.27X1.27MM; Component Kind: Standard (No BOM); Component Type: Standard (No BOM); Pin Count: 1; Family: Test Point; Socket: No; SMD: Yes; Sense: No; Status: None; ComponentHeight: 0mm; HelpURL: Undefined; Author: CERN DEM JLC; CreateDate: 12.01.2008; LatestRevisionDate: 12.01.2008; PackageDescription: 1.27mm x 1.27mm PCB Copper Area (SMD Test Point)